# EAGLE design child (EAGLE 7.4.0)
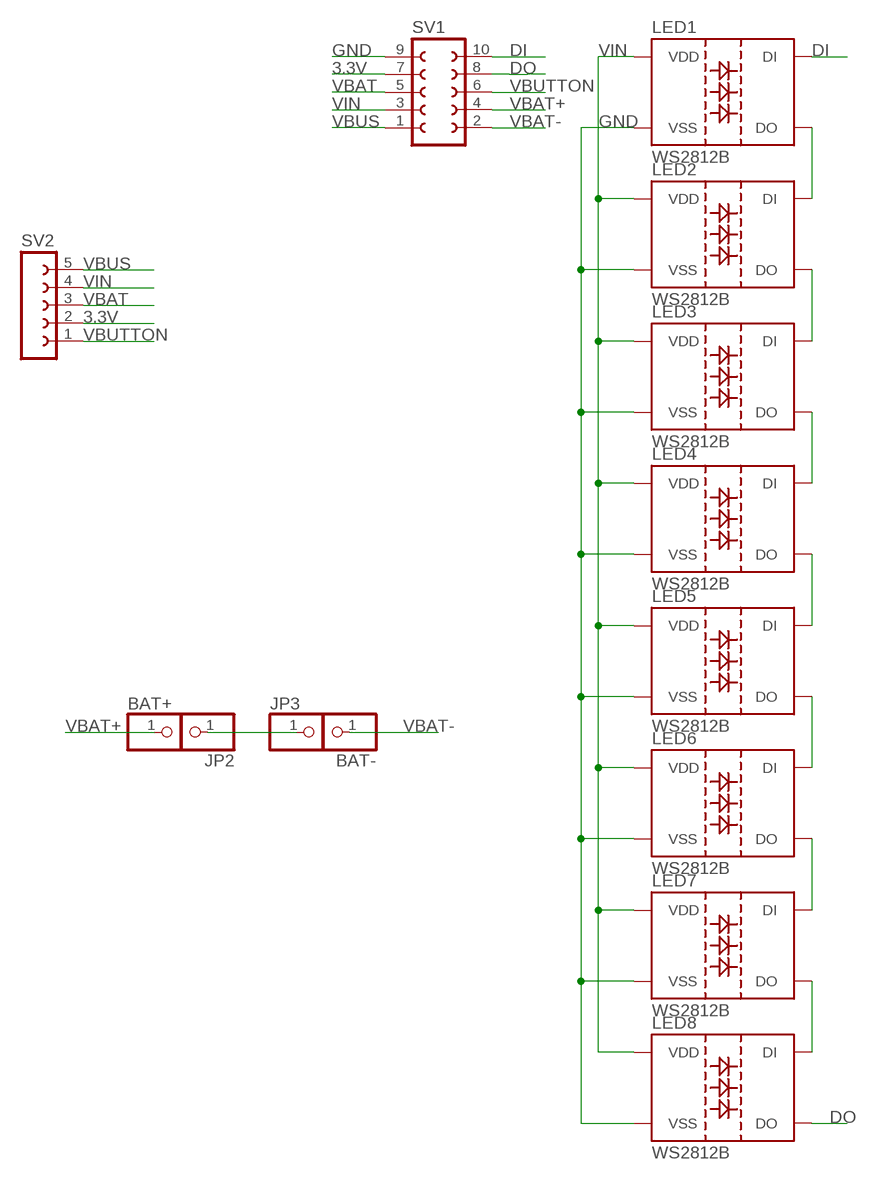
[diagram p0: schematic, sheet 1]

## Parts
BAT+  PINHD-1X1  [1X01]
BAT-  PINHD-1X1  [1X01]
JP2  PINHD-1X1  [1X01]
JP3  PINHD-1X1  [1X01]
LED1  WS2812B  [WS2812B]
LED2  WS2812B  [WS2812B]
LED3  WS2812B  [WS2812B]
LED4  WS2812B  [WS2812B]
LED5  WS2812B  [WS2812B]
LED6  WS2812B  [WS2812B]
LED7  WS2812B  [WS2812B]
LED8  WS2812B  [WS2812B]
SV1  FE05-2W  [FE05-2W]
SV2  FE05-1  [FE05-1]

## Nets
3.3V: SV1.7 SV2.2
DI: LED1.4(DI) SV1.10
DO: LED8.2(DO) SV1.8
GND: LED1.3(VSS) LED2.3(VSS) LED3.3(VSS) LED4.3(VSS) LED5.3(VSS) LED6.3(VSS) LED7.3(VSS) LED8.3(VSS) SV1.9
N$1: LED1.2(DO) LED2.4(DI)
N$2: LED2.2(DO) LED3.4(DI)
N$3: LED3.2(DO) LED4.4(DI)
N$4: LED4.2(DO) LED5.4(DI)
N$5: LED5.2(DO) LED6.4(DI)
N$6: LED6.2(DO) LED7.4(DI)
N$7: LED7.2(DO) LED8.4(DI)
N$9: JP2.1 JP3.1
VBAT: SV1.5 SV2.3
VBAT+: BAT+.1 SV1.4
VBAT-: BAT-.1 SV1.2
VBUS: SV1.1 SV2.5
VBUTTON: SV1.6 SV2.1
VIN: LED1.1(VDD) LED2.1(VDD) LED3.1(VDD) LED4.1(VDD) LED5.1(VDD) LED6.1(VDD) LED7.1(VDD) LED8.1(VDD) SV1.3 SV2.4

## Library data of the parts
BAT+ BAT- JP2 JP3 = pinhead:PINHD-1X1: PIN HEADER
LED1-LED8 = WS2812:WS2812B
SV1 = con-lsta:FE05-2W: FEMALE HEADER; OC_FARNELL: unknown; OC_NEWARK: unknown
SV2 = con-lsta:FE05-1: FEMALE HEADER; OC_FARNELL: unknown; OC_NEWARK: unknown

## Board
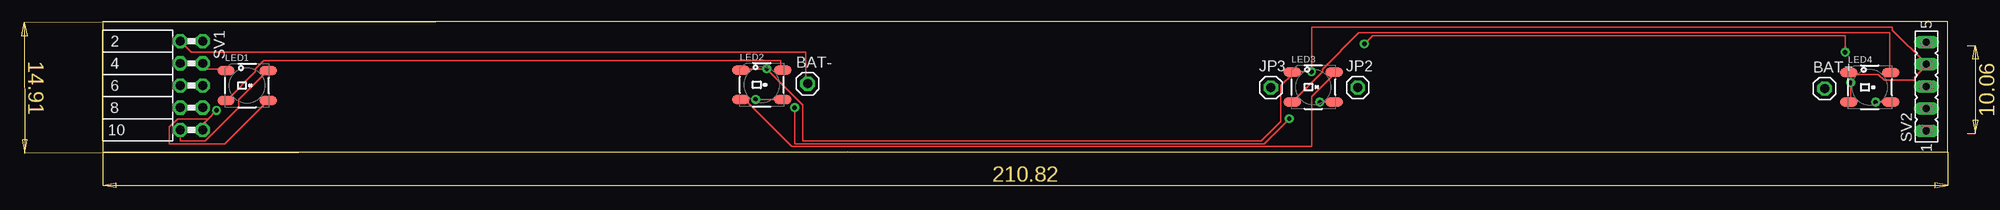
[diagram p1: board, top side]
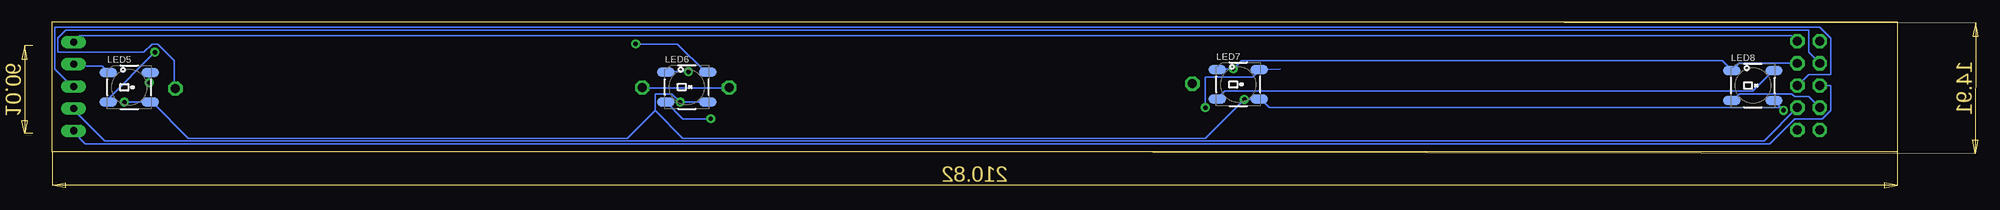
[diagram p2: board, bottom side, seen from below]

Size 210.8 x 14.91 mm. Coordinates in mm from the lower left corner, seen from the top.
Outline: 0,0 210.8,0 210.8,14.91 0,14.91 0,0
Copper layers (1*2*3*16): Top 0.035mm / dielectric 0.25mm / Route2 0.035mm / dielectric 0.25mm / Route3 0.035mm / dielectric 0.25mm / Bottom 0.035mm
Design rules "SparkFun": minimum track width 6mil, minimum drill 20mil, track to track 4mil, track to pad 4mil, pad to pad 4mil, via to via 4mil, smd to smd 4mil, copper to edge 8mil, drill to drill 8mil, minimum pad ring 12mil, minimum via ring 10mil, stop-mask expansion 4mil, vias tented up to drill 20mil, thermal gap 10mil
tRestrict: area 82.1,1.8 to 131.8,13.3; area 145.2,1.7 to 194.9,13.3
bRestrict: area 82.2,1.8 to 131.9,13.3; area 145.1,1.8 to 194.8,13.2

### Footprints (pad centres in the part's own frame; a part is rotated, then mirrored left to right if it is on the bottom)
1X01 = drill 1.016 octagon: 1 0,0
WS2812B = smd 2 x 1.1: 1 -2.4,1.7; 2 -2.4,-1.7; 3 2.4,-1.7; 4 2.4,1.7
FE05-2W = drill 1.016 octagon: 1 -5.08,1.27; 2 -5.08,-1.27; 3 -2.54,1.27; 4 -2.54,-1.27; 5 0,1.27; 6 0,-1.27; 7 2.54,1.27; 8 2.54,-1.27; 9 5.08,1.27; 10 5.08,-1.27
FE05-1 = drill 0.813 long: 1 -5.08,0; 2 -2.54,0; 3 0,0; 4 2.54,0; 5 5.08,0

### Placement (x,y rotation side)
BAT+  196.72,7.26 0 top
BAT-  80.54,7.82 0 top
JP2  143.41,7.39 0 top
JP3  133.48,7.39 0 top
LED1  16.51,7.62 0 top
LED2  75.31,7.7 0 top
LED3  138.33,7.44 0 top
LED4  201.9,7.42 0 top
LED5  202.01,7.42 0 bottom
LED6  138.3,7.44 0 bottom
LED7  75.31,7.75 0 bottom
LED8  16.51,7.62 0 bottom
SV1  10.16,7.62 270 top
SV2  208.36,7.52 90 top

### Tracks (layer width: path | path; a pad name or v marks a point on that pad's centre or on a via)
3.3V
  Bottom 0.152: SV1.7 15.24,1.27 204.79,1.27 208.28,4.76 SV2.2
DI
  Top 0.152: SV1.10 8.89,1.27 11.75,1.27 15.56,5.08 15.56,6.03 18.73,9.21 LED1.4
DO
  Bottom 0.152: SV1.8 10.16,6.35 11.75,6.35 12.06,6.67 18.1,6.67 18.73,6.03 LED8.2
GND  (via drill 0.51)
  Top 0.152: v202.56,5.71 204.15,5.71 LED4.3 | v139.06,5.71 140.65,5.71 LED3.3 | v74.61,6.03 77.47,6.03 LED2.3 | 12.06,3.81 11.43,3.18 SV1.9 | 12.06,3.81 v13.02,4.76 | 12.06,3.81 8.57,3.81 7.62,2.86 7.62,0.95 13.97,0.95 18.73,5.71 LED1.3
  Bottom 0.152: v202.56,5.71 199.71,5.71 LED5.3 199.39,5.71 195.26,1.59 145.1,1.59 141.92,4.76 | LED6.3 136.21,5.71 v139.06,5.71 140.02,6.67 141.92,6.67 141.92,4.76 | 13.34,5.08 13.97,5.71 LED8.3 | 13.34,5.08 71.75,5.08 72.71,6.03 LED7.3 73.03,6.03 v74.61,6.03 79.06,1.59 138.75,1.59 141.92,4.76 | 13.34,5.08 v13.02,4.76
N$1
  Top 0.152: LED1.2 14.29,6.03 17.46,9.21 17.46,9.53 18.41,10.48 77.47,10.48 77.47,9.53 LED2.4
N$2
  Top 0.152: LED2.2 73.03,5.71 73.66,5.71 78.74,0.64 138.11,0.64 138.11,6.35 140.65,8.89 LED3.4
N$3
  Top 0.152: LED3.2 136.21,6.03 139.38,9.21 139.38,9.53 143.51,13.65 204.15,13.65 204.15,9.21 LED4.4
N$4  (via drill 0.51)
  Top 0.152: v199.71,7.94 199.71,6.03 LED4.2
  Bottom 0.152: v199.71,7.94 199.71,8.89 LED5.4
N$5  (via drill 0.51)
  Top 0.152: v144.15,12.38 145.1,13.34 199.07,13.34 v199.07,11.43
  Bottom 0.152: v144.15,12.38 139.38,12.38 136.21,9.21 LED6.4 | v199.07,11.43 204.47,6.03 LED5.2
N$6  (via drill 0.51)
  Top 0.152: v135.57,3.81 132.72,0.95 79.06,0.95 v79.06,5.08
  Bottom 0.152: 70.48,9.53 LED7.4 73.03,9.21 73.66,8.57 79.06,8.57 v79.06,5.08 | v135.57,3.81 138.75,3.81 140.65,5.71 LED6.2
N$7
  Bottom 0.152: LED8.4 14.29,9.21 16.51,6.98 76.83,6.98 77.47,6.35 LED7.2
N$9
  Bottom 0.152: JP3.1 133.67,7.3 143.19,7.3 JP2.1
VBAT
  Bottom 0.152: SV1.5 10.16,8.89 7.62,8.89 7.62,13.02 8.89,14.29 210.5,14.29 210.5,9.53 208.6,7.62 SV2.3
VBAT+
  Bottom 0.152: SV1.4 10.16,11.43 10.16,13.97 209.23,13.97 210.19,13.02 210.19,11.43 200.34,11.43 199.39,12.38 198.75,12.38 196.85,10.48 196.85,7.3 BAT+.1
VBAT-
  Top 0.152: SV1.2 10.16,11.43 80.33,11.43 80.33,7.94 BAT-.1
VBUS
  Bottom 0.152: SV1.1 12.06,13.34 207.65,13.34 208.28,12.7 SV2.5
VBUTTON
  Bottom 0.152: SV1.6 7.62,7.62 7.62,4.76 8.57,3.81 11.75,3.81 14.61,0.95 207.01,0.95 208.28,2.22 SV2.1
VIN  (via drill 0.51)
  Top 0.152: LED4.1 199.71,8.89 202.88,8.89 203.52,8.25 207.01,8.25 207.01,8.57 208.28,9.84 SV2.4 208.28,10.16 204.47,13.97 204.47,14.29 138.11,14.29 v138.11,9.21 136.21,9.21 LED3.1 135.89,8.89 134.62,7.62 134.62,3.49 132.4,1.27 80.01,1.27 80.01,5.4 v75.88,9.53 73.03,9.53 LED2.1 | LED1.1 13.97,9.53 11.43,9.53 SV1.3
  Bottom 0.152: LED5.1 204.47,9.21 205.1,9.84 208.28,9.84 SV2.4 | SV1.3 18.1,10.16 18.73,9.53 LED8.1 19.05,9.53 20,10.48 74.93,10.48 v75.88,9.53 77.47,9.53 LED7.1 | v138.11,9.21 140.65,9.21 LED6.1